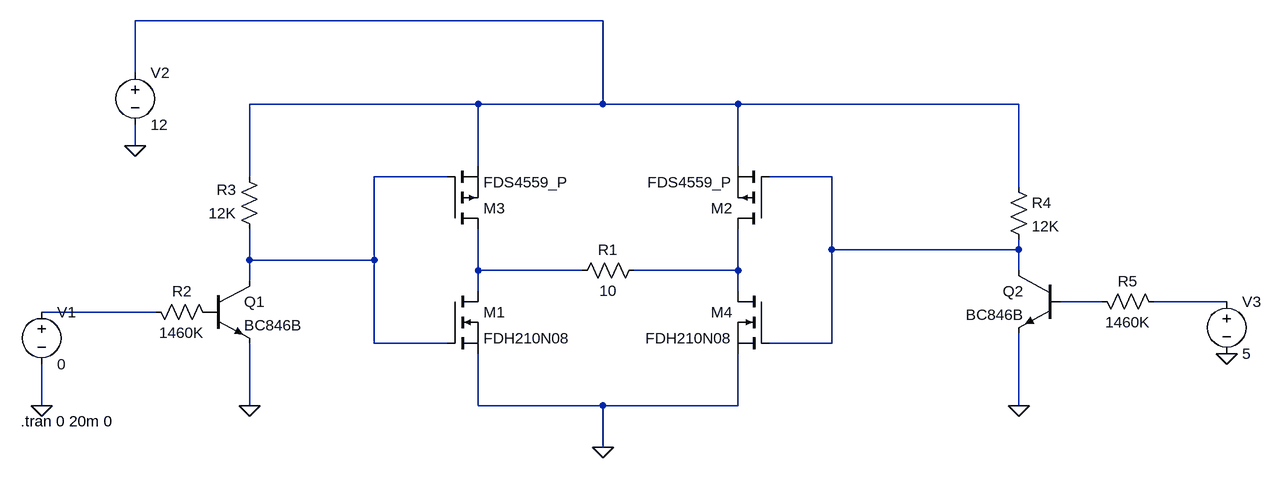
[diagram p0: schematic mostekH -PMOS - NMOS.asc]
mostekH -PMOS - NMOS.asc, the LTspice schematic file:
Version 4
SHEET 1 1800 680
WIRE 784 -352 64 -352
WIRE 64 -272 64 -352
WIRE 592 -224 240 -224
WIRE 784 -224 784 -352
WIRE 784 -224 592 -224
WIRE 992 -224 784 -224
WIRE 1424 -224 992 -224
WIRE 64 -160 64 -192
WIRE 592 -128 592 -224
WIRE 992 -128 992 -224
WIRE 240 -112 240 -224
WIRE 544 -112 432 -112
WIRE 1136 -112 1040 -112
WIRE 1424 -96 1424 -224
WIRE 1136 0 1136 -112
WIRE 1424 0 1424 -16
WIRE 1424 0 1136 0
WIRE 240 16 240 -32
WIRE 432 16 432 -112
WIRE 432 16 240 16
WIRE 592 32 592 -32
WIRE 752 32 592 32
WIRE 992 32 992 -32
WIRE 992 32 832 32
WIRE 1424 32 1424 0
WIRE 240 48 240 16
WIRE 592 64 592 32
WIRE 992 64 992 32
WIRE 1552 80 1488 80
WIRE 1744 80 1632 80
WIRE 96 96 -80 96
WIRE 432 144 432 16
WIRE 544 144 432 144
WIRE 1136 144 1136 0
WIRE 1136 144 1040 144
WIRE -80 240 -80 176
WIRE 240 240 240 144
WIRE 592 240 592 160
WIRE 784 240 592 240
WIRE 992 240 992 160
WIRE 992 240 784 240
WIRE 1424 240 1424 128
WIRE 784 304 784 240
FLAG -80 240 0
FLAG 240 240 0
FLAG 784 304 0
FLAG 64 -160 0
FLAG 1424 240 0
FLAG 1744 160 0
DATAFLAG 880 32 ""
DATAFLAG 672 32 ""
DATAFLAG 592 -176 ""
DATAFLAG 592 176 ""
DATAFLAG 1248 0 ""
DATAFLAG 336 16 ""
SYMBOL voltage -80 80 R0
WINDOW 123 0 0 Left 0
WINDOW 39 0 0 Left 0
SYMATTR InstName V1
SYMATTR Value 0
SYMBOL res 80 80 M90
WINDOW 0 0 56 VBottom 2
WINDOW 3 32 56 VTop 2
SYMATTR InstName R2
SYMATTR Value 1460K
SYMBOL res 256 -16 R180
WINDOW 0 36 76 Left 2
WINDOW 3 36 40 Left 2
SYMATTR InstName R3
SYMATTR Value 12K
SYMBOL npn 176 48 R0
SYMATTR InstName Q1
SYMATTR Value BC846B
SYMBOL nmos 544 64 R0
SYMATTR InstName M1
SYMATTR Value FDH210N08
SYMBOL pmos 544 -32 M180
SYMATTR InstName M3
SYMATTR Value FDS4559_P
SYMBOL pmos 1040 -32 R180
SYMATTR InstName M2
SYMATTR Value FDS4559_P
SYMBOL nmos 1040 64 M0
SYMATTR InstName M4
SYMATTR Value FDH210N08
SYMBOL voltage 64 -288 R0
WINDOW 123 0 0 Left 0
WINDOW 39 0 0 Left 0
SYMATTR InstName V2
SYMATTR Value 12
SYMBOL voltage 1744 64 R0
WINDOW 123 0 0 Left 0
WINDOW 39 0 0 Left 0
SYMATTR InstName V3
SYMATTR Value 5
SYMBOL npn 1488 32 M0
SYMATTR InstName Q2
SYMATTR Value BC846B
SYMBOL res 1408 -112 R0
SYMATTR InstName R4
SYMATTR Value 12K
SYMBOL res 1536 64 M90
WINDOW 0 0 56 VBottom 2
WINDOW 3 32 56 VTop 2
SYMATTR InstName R5
SYMATTR Value 1460K
SYMBOL res 848 16 R90
WINDOW 0 0 56 VBottom 2
WINDOW 3 32 56 VTop 2
SYMATTR InstName R1
SYMATTR Value 10
TEXT -112 264 Left 2 !.tran 0 20m 0

The netlist it stands for:
* mostekH -PMOS - NMOS.asc
V1 N008 0 0
R2 N008 P001 1460K
R3 N002 N001 12K
Q1 N002 P001 0 0 BC846B
M1 N004 N002 0 0 FDH210N08
M3 N004 N002 N001 N001 FDS4559_P
M2 N005 N003 N001 N001 FDS4559_P
M4 N005 N003 0 0 FDH210N08
V2 N001 0 12
V3 N007 0 5
Q2 N003 N006 0 0 BC846B
R4 N001 N003 12K
R5 N006 N007 1460K
R1 N005 N004 10
.model NPN NPN
.model PNP PNP
.lib standard.bjt
.model NMOS NMOS
.model PMOS PMOS
.lib standard.mos
.tran 0 20m 0
.backanno
.end